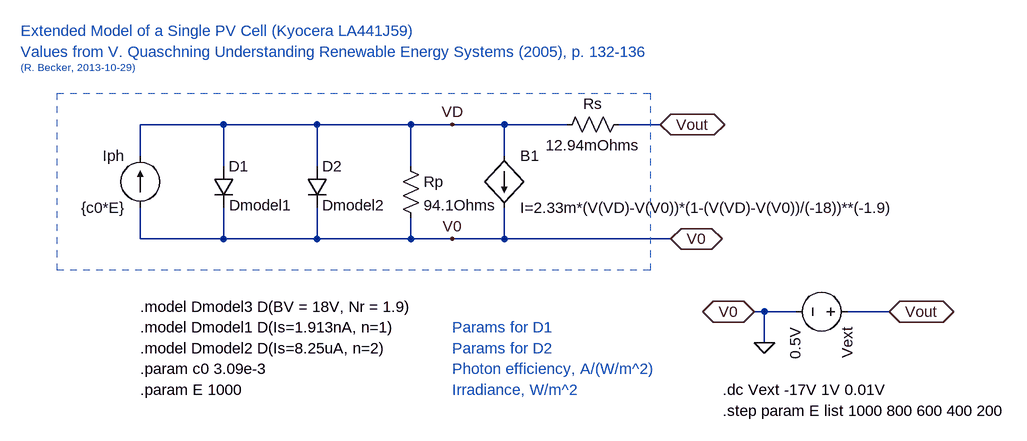
[diagram p0: schematic PVcellExt_Test.asc]
PVcellExt_Test.asc, the LTspice schematic file:
Version 4
SHEET 1 1244 680
WIRE 0 32 -128 32
WIRE 144 32 0 32
WIRE 288 32 144 32
WIRE 352 32 288 32
WIRE 432 32 352 32
WIRE 528 32 432 32
WIRE 672 32 608 32
WIRE -128 80 -128 32
WIRE 432 80 432 32
WIRE 0 96 0 32
WIRE 144 96 144 32
WIRE 288 96 288 32
WIRE -128 208 -128 160
WIRE 0 208 0 160
WIRE 0 208 -128 208
WIRE 144 208 144 160
WIRE 144 208 0 208
WIRE 288 208 288 176
WIRE 288 208 144 208
WIRE 352 208 288 208
WIRE 432 208 432 160
WIRE 432 208 352 208
WIRE 688 208 432 208
WIRE 832 320 816 320
WIRE 880 320 832 320
WIRE 1024 320 960 320
WIRE 832 368 832 320
FLAG 672 32 Vout
IOPIN 672 32 BiDir
FLAG 688 208 V0
IOPIN 688 208 BiDir
FLAG 352 32 VD
FLAG 352 208 V0
FLAG 1024 320 Vout
IOPIN 1024 320 BiDir
FLAG 816 320 V0
IOPIN 816 320 BiDir
FLAG 832 368 0
SYMBOL diode -16 96 R0
WINDOW 3 25 60 Left 2
SYMATTR Value Dmodel1
SYMATTR InstName D1
SYMBOL current -128 160 R180
WINDOW 0 24 80 Left 2
WINDOW 3 24 0 Left 2
SYMATTR InstName Iph
SYMATTR Value {c0*E}
SYMBOL diode 128 96 R0
WINDOW 3 24 60 Left 2
SYMATTR Value Dmodel2
SYMATTR InstName D2
SYMBOL res 272 80 R0
SYMATTR InstName Rp
SYMATTR Value 94.1Ohms
SYMBOL res 624 16 R90
WINDOW 0 0 56 VBottom 2
WINDOW 3 32 56 VTop 2
SYMATTR InstName Rs
SYMATTR Value 12.94mOhms
SYMBOL bi 432 80 R0
SYMATTR InstName B1
SYMATTR Value I=2.33m*(V(VD)-V(V0))*(1-(V(VD)-V(V0))/(-18))**(-1.9)
SYMBOL voltage 976 320 R90
WINDOW 123 0 0 Left 2
WINDOW 39 0 0 Left 2
SYMATTR InstName Vext
SYMATTR Value 0.5V
TEXT -128 344 Left 2 !.model Dmodel1 D(Is=1.913nA, n=1)
TEXT -128 376 Left 2 !.model Dmodel2 D(Is=8.25uA, n=2)
TEXT -128 408 Left 2 !.param c0 3.09e-3
TEXT -312 -80 Left 2 ;Values from V. Quaschning Understanding Renewable Energy Systems (2005), p. 132-136
TEXT -312 -112 Left 2 ;Extended Model of a Single PV Cell (Kyocera LA441J59)
TEXT -312 -56 Left 1 ;(R. Becker, 2013-10-29)
TEXT -128 440 Left 2 !.param E 1000
TEXT 352 440 Left 2 ;Irradiance, W/m^2
TEXT 352 408 Left 2 ;Photon efficiency, A/(W/m^2)
TEXT 352 344 Left 2 ;Params for D1
TEXT 352 376 Left 2 ;Params for D2
TEXT -128 312 Left 2 !.model Dmodel3 D(BV = 18V, Nr = 1.9)
TEXT 768 440 Left 2 !.dc Vext -17V 1V 0.01V
TEXT 768 472 Left 2 !.step param E list 1000 800 600 400 200
RECTANGLE Normal 656 256 -256 -16 1

The netlist it stands for:
* PVcellExt_Test.asc
D1 VD 0 Dmodel1
Iph 0 VD {c0*E}
D2 VD 0 Dmodel2
Rp VD 0 94.1Ohms
Rs Vout VD 12.94mOhms
B1 VD 0 I=2.33m*(V(VD)-V(V0))*(1-(V(VD)-V(V0))/(-18))**(-1.9)
Vext Vout 0 0.5V
.model D D
.lib standard.dio
.model Dmodel1 D(Is=1.913nA, n=1)
.model Dmodel2 D(Is=8.25uA, n=2)
.param c0 3.09e-3
* Values from V. Quaschning Understanding Renewable Energy Systems (2005), p. 132-136
* Extended Model of a Single PV Cell (Kyocera LA441J59)
* (R. Becker, 2013-10-29)
.param E 1000
* Irradiance, W/m^2
* Photon efficiency, A/(W/m^2)
* Params for D1
* Params for D2
.model Dmodel3 D(BV = 18V, Nr = 1.9)
.dc Vext -17V 1V 0.01V
.step param E list 1000 800 600 400 200
.backanno
.end

* Results of the author's LTspice run, read from the files saved beside the schematic
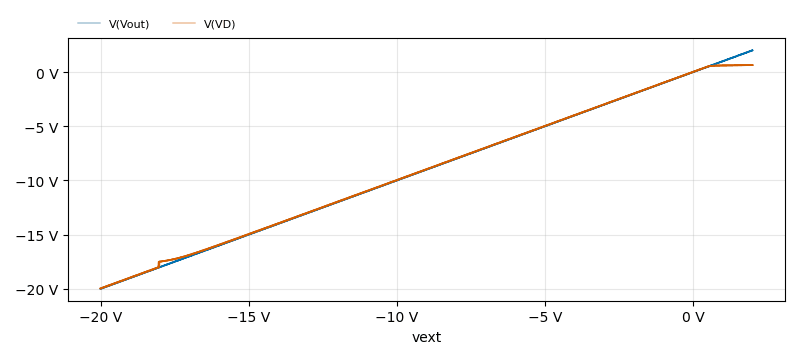
[diagram p1: DC transfer characteristic of PVcellExt_Test.asc, plotted from the saved traces]
* DC transfer characteristic, 5 runs:
*   V(Vout) [run 1]: -20 V at vext=-20 V, 2 V at vext=2 V, min -20 V, max 2 V
*   V(Vout) [run 2]: -20 V at vext=-20 V, 2 V at vext=2 V, min -20 V, max 2 V
*   V(Vout) [run 3]: -20 V at vext=-20 V, 2 V at vext=2 V, min -20 V, max 2 V
*   V(Vout) [run 4]: -20 V at vext=-20 V, 2 V at vext=2 V, min -20 V, max 2 V
*   V(Vout) [run 5]: -20 V at vext=-20 V, 2 V at vext=2 V, min -20 V, max 2 V
*   V(VD) [run 1]: -19.99 V at vext=-20 V, 639.3 mV at vext=2 V, min -19.99 V, max 639.3 mV
*   V(VD) [run 2]: -19.98 V at vext=-20 V, 639.5 mV at vext=2 V, min -19.98 V, max 639.5 mV
*   V(VD) [run 3]: -19.97 V at vext=-20 V, 639.6 mV at vext=2 V, min -19.97 V, max 639.6 mV
*   V(VD) [run 4]: -19.97 V at vext=-20 V, 639.8 mV at vext=2 V, min -19.97 V, max 639.8 mV
*   V(VD) [run 5]: -19.96 V at vext=-20 V, 639.9 mV at vext=2 V, min -19.96 V, max 639.9 mV